# EAGLE schematic avatar3.0 (EAGLE 8.0.1)
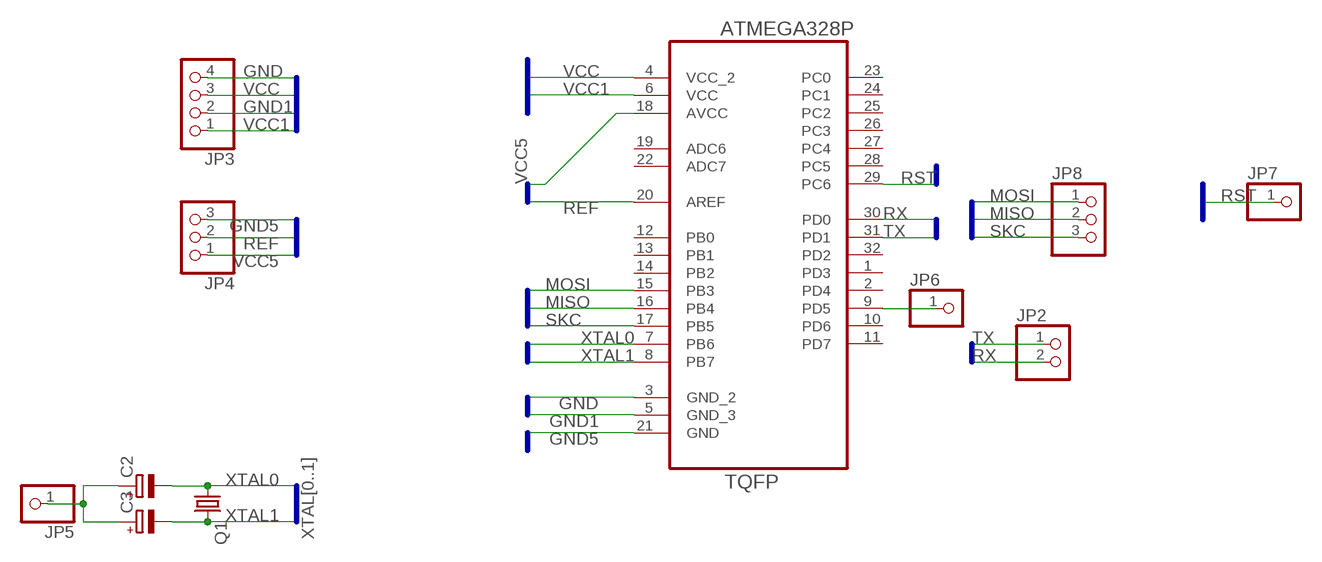
[diagram p0: schematic, sheet 1]

## Parts
C2  CPOL-EUE1.8-4  [E1,8-4]
C3  CPOL-EUE1.8-4  [E1,8-4]
JP2  PINHD-1X2  [1X02]
JP3  PINHD-1X4  [1X04]
JP4  PINHD-1X3  [1X03]
JP5  PINHD-1X1  [1X01]
JP6  PINHD-1X1  [1X01]
JP7  PINHD-1X1  [1X01]
JP8  PINHD-1X3  [1X03]
Q1  CRYSTALHC49U-V  [HC49U-V]
U1  ATMEGA328P-AU  [QFP80P900X900X120-32N]

## Nets
GND: JP3.4 U1.3(GND_2)
GND1: JP3.2 U1.5(GND_3)
GND5: JP4.3 U1.21(GND)
MISO: JP8.2 U1.16(PB4)
MOSI: JP8.1 U1.15(PB3)
N$1: C2.+ C3.+ JP5.1
N$2: JP6.1 U1.9(PD5)
REF: JP4.2 U1.20(AREF)
RST: JP7.1 U1.29(PC6)
RX: JP2.2 U1.30(PD0)
SKC: JP8.3 U1.17(PB5)
TX: JP2.1 U1.31(PD1)
VCC: JP3.3 U1.4(VCC_2)
VCC1: JP3.1 U1.6(VCC)
VCC5: JP4.1 U1.18(AVCC)
XTAL0: C2.- Q1.1 U1.7(PB6)
XTAL1: C3.- Q1.2 U1.8(PB7)
Unconnected: U1.1(PD3) U1.2(PD4) U1.10(PD6) U1.11(PD7) U1.12(PB0) U1.13(PB1) U1.14(PB2) U1.19(ADC6) U1.22(ADC7) U1.23(PC0) U1.24(PC1) U1.25(PC2) U1.26(PC3) U1.27(PC4) U1.28(PC5) U1.32(PD2)

## Buses
XTAL[0..1]
MISO,MOSI,SKC,RST
TX,RX
GND,VCC,GND1,VCC1
GND5,REF,VCC5

## Library data of the parts
C2 C3 = rcl:CPOL-EU: POLARIZED CAPACITOR, European symbol
JP2 = pinhead:PINHD-1X2: PIN HEADER
JP3 = pinhead:PINHD-1X4: PIN HEADER
JP4 JP8 = pinhead:PINHD-1X3: PIN HEADER
JP5-JP7 = pinhead:PINHD-1X1: PIN HEADER
Q1 = crystal:CRYSTAL: CRYSTAL; OC_FARNELL: 1666969; OC_NEWARK: unknown
U1 = Ava:ATMEGA328P-AU; DESCRIPTION: 8-bit Microcontroller with In-System Programmable Flash; MPN: ATMEGA328P-AU; OC_FARNELL: 1715486; OC_NEWARK: 14R4631; PACKAGE: TQFP-32; SUPPLIER: Atmel